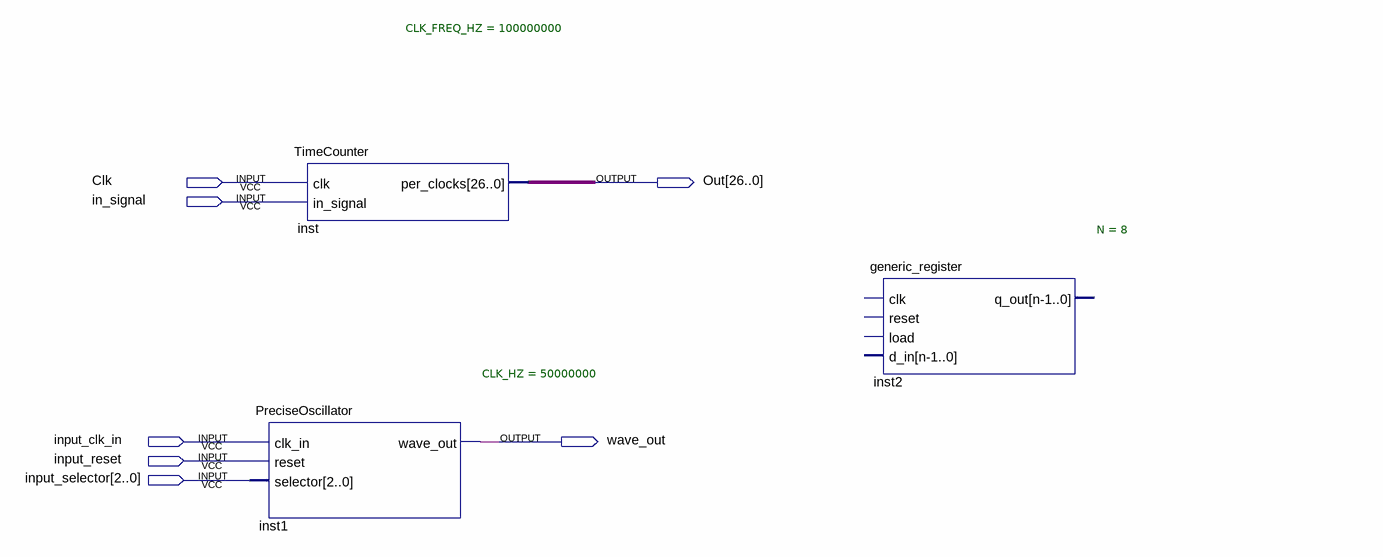
[diagram p0: schematic sheet]
// Quartus schematic Afinador.bdf as structural Verilog: 3 symbols, 7 pins
module Afinador (
  input  Clk,
  input  in_signal,
  input  input_clk_in,
  input  input_reset,
  input  [2:0] input_selector,
  output [26:0] Out,
  output wave_out
);

  TimeCounter #(.CLK_FREQ_HZ(100000000)) inst (.clk(Clk), .in_signal(in_signal), .per_clocks(Out));
  PreciseOscillator #(.CLK_HZ(50000000)) inst1 (
    .clk_in(input_clk_in), .reset(input_reset), .selector(input_selector), .wave_out(wave_out));
  generic_register #(.N(8)) inst2 ();  // open: clk, reset, load, d_in, q_out
endmodule
